# EAGLE design KK V5.5_Yaw_breakout (EAGLE 5.08)
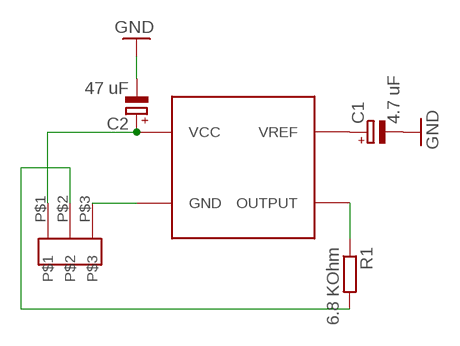
[diagram p0: schematic, sheet 1]

## Parts
C1  4.7 uF  CPOL-EUSMCB  [SMC_B]
C2  47 uF  CPOL-EUSMCB  [SMC_B]
IC1  ENC-03RC  [ENC-03RC]
R1  6.8 KOhm  R-EU_R0805  [R0805]
U$1  EDGE3  [EGDE3]

## Nets
GND: C1.- C2.- IC1.GND U$1.P$3
N$1: IC1.OUTPUT R1.1
N$2: C1.+ IC1.VREF
N$4: C2.+ IC1.VCC U$1.P$1
N$5: R1.2 U$1.P$2

## Library data of the parts
C1 C2 = rcl:CPOL-EU: POLARIZED CAPACITOR, European symbol
IC1 = gyros:ENC-03RC
R1 = rcl:R-EU_: RESISTOR, European symbol
U$1 = Egde:EDGE3

## Board
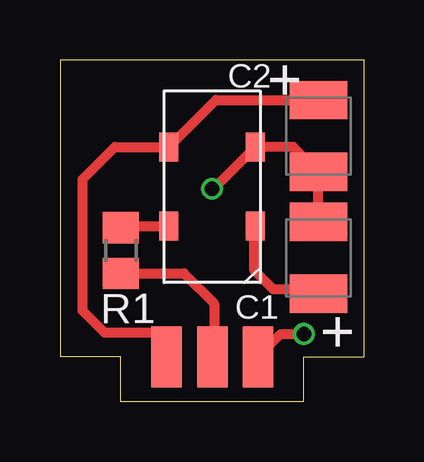
[diagram p1: board, top side]
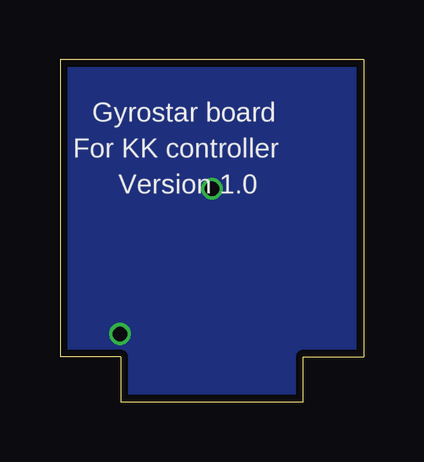
[diagram p2: board, bottom side, seen from below]

Size 12.66 x 14.27 mm. Coordinates in mm from the lower left corner, seen from the top.
Outline: 0,14.27 12.66,14.27 12.66,1.89 10.14,1.89 10.14,0 2.53,0 2.53,1.89 0,1.89 0,14.27
Copper layers (1*16): Top 0.035mm / dielectric 1.5mm / Bottom 0.035mm
Design rules "Fusion_eagle_rule_v1.1": minimum track width 6mil, minimum drill 12mil, track to track 6mil, track to pad 6mil, pad to pad 6mil, via to via 6mil, smd to smd 0mil, copper to edge 10mil, drill to drill 10mil, minimum pad ring 10mil, minimum via ring 6mil, stop-mask expansion 2mil, vias tented up to drill 100mil, thermal gap 10mil

### Footprints (pad centres in the part's own frame; a part is rotated, then mirrored left to right if it is on the bottom)
SMC_B = smd 1.6 x 2.4: + -1.5,0; - 1.5,0
ENC-03RC = smd 1.2 x 0.8: GND 1.65,-1.8; OUTPUT -1.65,1.8; VCC 1.65,1.8; VREF -1.65,-1.8
R0805 = smd 1.3 x 1.5: 1 -0.95,0; 2 0.95,0
EGDE3 = smd 1.27 x 2.54: P$1 -5.08,1.27; P$2 -3.175,1.27; P$3 -1.27,1.27

### Placement (x,y rotation side)
C1  10.77,6.01 90 top
C2  10.77,11.1 270 top
IC1  6.34,8.99 90 top
R1  2.54,6.32 270 top
U$1  9.53,0.62 0 top

### Tracks (layer width: path | path; a pad name or v marks a point on that pad's centre or on a via)
GND  (via drill 0.6)
  Top 0.406: v6.34,8.9 6.4,8.9 IC1.GND 9.73,10.64 C2.- C1.- | U$1.P$3 9.21,2.84 v10.16,2.84
  pour Bottom (isolate 0.305): 0,14.27 12.7,14.27 12.7,1.57 10.16,1.57 10.16,-0.2 2.54,-0.3 2.54,1.57 0,1.57
N$1
  Top 0.406: IC1.OUTPUT 2.61,7.34 R1.1
N$2
  Top 0.406: C1.+ 10.77,4.7 8.88,4.7 8.1,5.48 8.1,7.3 IC1.VREF
N$4
  Top 0.305: U$1.P$1 4.45,2.84
  Top 0.406: C2.+ 6.5,12.6 IC1.VCC 2.29,10.64 0.94,9.29 0.94,3.8 1.85,2.89 4.39,2.89 4.45,2.84
N$5
  Top 0.406: R1.2 5.17,5.37 6.43,4.11 6.43,1.96 U$1.P$2

### Text on the board
tNames: + | +
bNames: Gyrostar board | For KK controller | Version 1.0